# Altium schematic sheet Boost Converter.SchDoc
size A; SheetNumber: 2; SheetTotal: 4
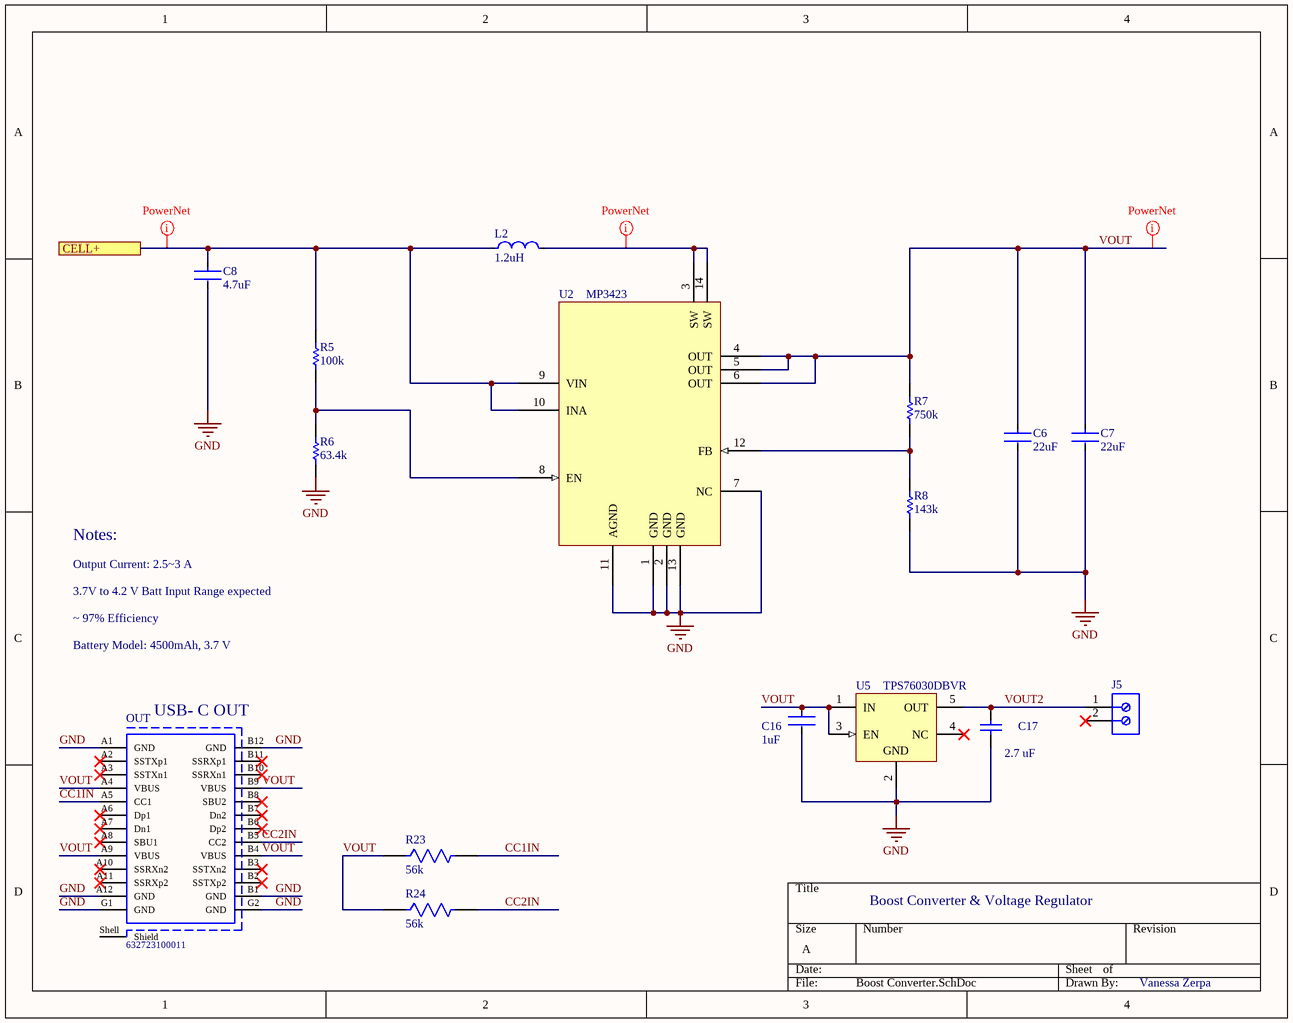
[diagram p0: Boost Converter.SchDoc]

## Parts
C6  22uF  [FP-GRM21B-0_15-MFG]
C7  22uF  [FP-GRM21B-0_15-MFG]
C8  4.7uF  [FP-0805-L_2_01_0_2-W_1_25-MFG]
C16  1uF  [FP-CC0805-0_85-MFG]
C17  2.7 uF  [CAPC2013X145X50LL20T25]
J5  691101710002  [691101710002]  (value not drawn)
L2  1.2uH  [FP-LQW21HN_00-MFG]
OUT  632723100011  [632723100011]
R5  100k  [RESC2013X60X35ML10T20]
R6  63.4k  [RESC2013X50X30LL20T20]
R7  750k  [RESC2013X50X30LL20T20]
R8  143k  [RESC2013X70X40LL20T20]
R23  56k  [FP-CRCW0805-e3-IPC_B]
R24  56k  [FP-CRCW0805-e3-IPC_B]
U2  MP3423  [MP3422GGZ]
U5  TPS76030DBVR  [DBV0005A_L]

## Ports
CELL+

## Nets
GND: C6.2 C7.2 C8.2 C16.2 C17.2 OUT.A1(GND) OUT.A12(GND) OUT.B1(GND) OUT.B12(GND) OUT.G1(GND) OUT.G2(GND) R6.1 R8.1 U2.1(GND) U2.2(GND) U2.7(NC) U2.11(AGND) U2.13(GND) U5.2(GND)
CC1IN: OUT.A5(CC1) R23.2
CC2IN: OUT.B5(CC2) R24.2
CELL+: C8.1 L2.1 R5.2 U2.9(VIN) U2.10(INA) ; port CELL+
VOUT: C6.1 C7.1 C16.1 OUT.A4(VBUS) OUT.A9(VBUS) OUT.B4(VBUS) OUT.B9(VBUS) R7.2 R23.1 R24.1 U2.4(OUT) U2.5(OUT) U2.6(OUT) U5.1(IN) U5.3(EN)
VOUT2: C17.1 J5.1 U5.5(OUT)
NetL2_2: L2.2 U2.3(SW) U2.14(SW)
NetR5_1: R5.1 R6.2 U2.8(EN)
NetR7_1: R7.1 R8.2 U2.12(FB)

Not connected (* = marked no-connect by the designer): J5 2*; OUT A2(SSTXp1)* A3(SSTXn1)* A6(Dp1)* A7(Dn1)* A8(SBU1)* A10(SSRXn2)* A11(SSRXp2)* B2(SSTXp2)* B3(SSTXn2)* B6(Dp2)* B7(Dn2)* B8(SBU2)* B10(SSRXn1)* B11(SSRXp1)* Shell(Shield); U5 4(NC)*

## Layout directives
net class PowerNets: CELL+, NetL2_2, VOUT

## Notes on the sheet
- Notes:
- Output Current: 2.5~3 A
- 3.7V to 4.2 V Batt Input Range expected
- ~ 97% Efficiency
- Battery Model: 4500mAh, 3.7 V
- (near OUT) USB- C OUT
- Boost Converter & Voltage Regulator
- Vanessa Zerpa

## Library data of the parts
C6 C7 = CMP-2007-03385-2: Chip Multilayer Ceramic Capacitors for General Purpose, 0805, 22uF, X5R, 15%, 20%, 6.3V; Material: Ceramic; Max Operating Temperature: 85°C; Voltage: 6.3V; Min Operating Temperature: -55°C; Case/Package: 0805; Thickness: 0.053inch; Dielectric: X5R; Packaging: Tape and Reel; Depth: 1.25mm; Termination: SMD/SMT; Voltage Rating (DC): 6.3V; Radiation Hardening: No; Tolerance: 20%; Mount: Surface Mount; Lead Free: Lead Free; Package Quantity: 1; REACH SVHC: No SVHC; Voltage Rating: 6.3V; Capacitance: 22uF; Length: 2mm; Case Code (Imperial): 0805; Case Code (Metric): 2012; Width: 0.049inch; Height: 1.25mm
C8 = CMP-2007-04518-2: General Purpose Ceramic Capacitor, 0805, 4.7uF, 10%, X7R, 15%, 16V; Dissipation Factor: 3.5%; Voltage: 10V; Height: 1.52mm; Package Quantity: 1; Voltage Rating: 16V; RoHS Compliant: Yes; Mount: Surface Mount; REACH SVHC: No SVHC; Number of Pins: 2; Packaging: Tape and Reel; Radiation Hardening: No; Thickness: 0.06inch; Width: 0.049inch; Length: 2.01mm; Termination: SMD/SMT; Case Code (Metric): 2012; Max Operating Temperature: 125°C; Construction: Flat; Series: -; Depth: 1.25mm; Voltage Rating (DC): 16V; Dielectric: X7R; Contact Plating: Tin; Tolerance: 10%; Capacitance: 4.7uF; Lead Free: Lead Free; Min Operating Temperature: -55°C; Case Code (Imperial): 0805; Case/Package: 0805
C16 = CMP-03422-000182-1: CAP CER 1UF 10V X7R 0805; Manufacturer: Yageo; Manufacturer Part Number: CC0805KKX7R6BB105; Material: Ceramic; Tolerance: 0.1; Value: 1 uF; ComponentLink2URL: http://www.yageo.com/documents/recent/UPY-GPHC_Y5V_6.3V-to-50V_8.pdf; Automotive: No; Temperature Range Low: -30°C; Octopart: https://octopart.com/cc0805kkx7r6bb105-yageo-42522859; Temperature Characteristic: X7R; RoHS: TRUE; Voltage Rating: 10 V; Capacitance: 1 uF; Package: CC0805-0.85; Device Class L3: Ceramic Capacitors; Category: Cap; Mouser Description: Multilayer Ceramic Capacitors MLCC - SMD/SMT 1.0uF 10V X7R 10%; Temperature Range High: +85°C; Ipc Land Pattern Name: CAPC200125X85; ComponentLink2Description: Datasheet; Temperature: -30°C to +85°C; Height: 0.95mm; Lead Free: Yes; Device Class L1: Passive Components; Device Class L2: Capacitors; Footprint Url: http://www.yageo.com/exep/pages/download/literatures/UPY-C_GEN_24.pdf; Digikey Description: CAP CER 1UF 10V X7R 0805
C17 = CMP-1036-04849-2: Part Number: C0805C275K8PACTU; Manufacturer: Kemet
J5 = CMP-1502-03256-1: Series 101 - 5.00 mm Horizontal Entry Modular with Pressure Clamp WR-TBL, 2 pin; Manufacturer: Wurth Elektronik; Pin Number: 2; Pitch: 5.00mm; Package Reference: 691101710002; Part Number: 691101710002; Publisher: WurthElektronik; Datasheet URL: http://katalog.we-online.de/em/datasheet/6911017100xx.pdf; Packaging: Box; Operating Temperature: -40to105degC; Manufacturer URL: http://www.we-online.de; Mounting Technology: THT
L2 = CMP-06042-002176-1: Wire Wound Ferrite type RF Inuctor 1.2uH ±5% 100mA 3.12Ω 0805 (2012); DC Resistance (DCR): 3.12R; Shielding: Unshielded; Self Resonant Frequency: 400MHz; Test Frequency: 10MHz; Q Factor: 35; Case Code (Imperial): 0805; Military Standard: Not; Inductance: 1.2uH; Packaging: Tape and Reel; Package Quantity: 3000; Case/Package: 0805; Resistor Type: Wirewound; Width: 1.5mm; Height - Seated (Max): 0.039inch; Tolerance: 5%; Lead Free: Lead Free; Termination: SMD/SMT; Current Rating: 100mA; Length: 2mm; Depth: 1.4mm; DC Current: 100mA; Height: 0.9mm; Min Operating Temperature: -55°C; Mount: Surface Mount; Case Code (Metric): 2012; Radiation Hardening: No; Weight: 0.000282oz; Max Operating Temperature: 85°C; Max DC Current: 100mA; Core Material: Ferrite
OUT = CMP-1502-03213-1: USB 3.1 Type C Receptacle WR-COM, Horizontal, SMT / THT; Manufacturer: Wurth Elektronik; Working Voltage: 20VDC; Rated Current: 5A; Contact Resistance: 30mOhm; Operating Temperature: -40to105degC; Publisher: WurthElektronik; Gender: Receptacle; Part Number: 632723100011; Mounting Technology: SMT/THT; Datasheet URL: https://katalog.we-online.de/em/datasheet/632723x00011%282%29.pdf; Connector Type: USB3.1TypeC; Manufacturer URL: http://www.we-online.de; Orientation: Horizontal; Package Reference: 632723100011; Packaging: TapeandReel
R5 = CMP-2100-03668-1: Chip Resistor, 100 KOhm, +/- 1%, 0.125 W, -55 to 155 degC, 0805 (2012 Metric), RoHS, Tape and Reel; Manufacturer: Yageo; Max Power Dissipation: 125mW; Voltage Rating: 150V; Temperature Coefficient: 100ppm/degreesC; Manufacturer URL: http://www.yageo.com/; Min Operating Temperature: -55degC; Lead Pitch: 0.4mm; Composition: ThickFilm; Case Code (Metric): 2012; Military Standard: Not; Package Description: 2-Pin Surface Mounted Device, Body 2 x 1.25 mm; REACH SVHC: Unknown; RoHSCompliant: true; Depth: 1.25mm; Number of Pins: 2; Lead Free: LeadFree; Resistance: 100KOhm; Datasheet URL: http://www.yageo.com/NewPortal/yageodocoutput?fileName=/pdf/R-Chip/PYu-RC_Group_51_RoHS_L_5.pdf; Max Operating Temperature: 155degC; Case/Package: 0805; Package Quantity: 1; Case Code (Imperial): 0805; Power Rating: 125mW; Width: 0.049inch; Package Reference: 0805; Height: 0.024inch; Termination: SMD/SMT; Tolerance: 1%; Datasheet Version: Rev. 5, 10/2016; Length: 2mm; Voltage Rating (DC): 150V; Number of Terminations: 2; Packaging: TapeandReel
R6 = CMP-2001-04057-1: Part Number: CRCW080563K4FKEA; Manufacturer: Vishay Dale
R7 = CMP-2001-04102-1: Manufacturer: Vishay Dale; Part Number: CRCW0805750KFKEA
R8 = CMP-2001-04433-1: Manufacturer: Panasonic; Part Number: ERJ-6ENF1433V
R23 R24 = CMP-2001-04015-2: RES Thick Film, 56kΩ, 1%, 0.125W, 100ppm/°C, 0805; Resistance: 56kR; Power Rating: 125mW; Voltage Rating: 150V; Depth: 1.25mm; Contact Plating: Tin; Package Quantity: 10; Min Operating Temperature: -55°C; Case/Package: 0805; Packaging: Tape and Reel; Lead Free: Lead Free; Case Code (Imperial): 0805; Tolerance: 1%; Height: 0.45mm; Max Operating Temperature: 155°C; Case Code (Metric): 2012; Number of Pins: 2; Width: 1.25mm; Mount: Surface Mount; Voltage Rating (DC): 150V; Max Power Dissipation: 125mW; Weight: 0.000194oz; Termination: SMD/SMT; Length: 2mm; Radiation Hardening: No; Composition: Thick Film; Features: Automotive AEC-Q200; Number of Terminations: 2; Temperature Coefficient: 100ppm/°C; Military Standard: Not
U5 = CMP-0394-00493-2: Single Output LDO, 50 mA, Fixed 3 V Output, 3.2 to 16 V Input, with Low IQ, 5-pin SOT-23 (DBV), -40 to 125 degC, Green (RoHS & no Sb/Br); Manufacturer: Texas Instruments; Accuracy(%): 2; Vin(Max)(V): 16; Iq(Typ)(mA): 0.8; Iout(Max)(A): 0.05; Vin(Min)(V): 3.2; Vout Adj(Max)(V): 3; SubFamily: Single Channel LDO; Vdo(Typ)(mV): 120; Rating: Catalog; ComponentLink1URL: http://www.ti.com/; ComponentLink1Description: Manufacturer URL; Code_JEDEC: MO-178; PackageDescription: 5-Pin Plastic Small Outline, Body 1.60 Ãƒâ€” 2.90 mm, Pitch 0.95 mm; PartNumber: TPS76030DBVR; ComponentLink2Description: Datasheet; Mounting Technology: Surface Mount; ComponentLink3Description: Package Specification; ComponentLink2URL: http://www.ti.com/general/docs/lit/getliterature.tsp?genericPartNumber=TPS76030&fileType=pdf; ComponentLink3URL: http://www.ti.com/litv/pdf/mpds018i; Eco-Plan: Green (RoHS & no Sb/Br); DatasheetVersion: SLVS144D; PackageVersion: 4073253-4/K; Fixed Output Options(V): 3; Vout Adj(Min)(V): 3; PackageReference: DBV0005A